# Altium schematic sheet Digital_IO.SchDoc
size A4; SheetNumber: 3; SheetTotal: 4
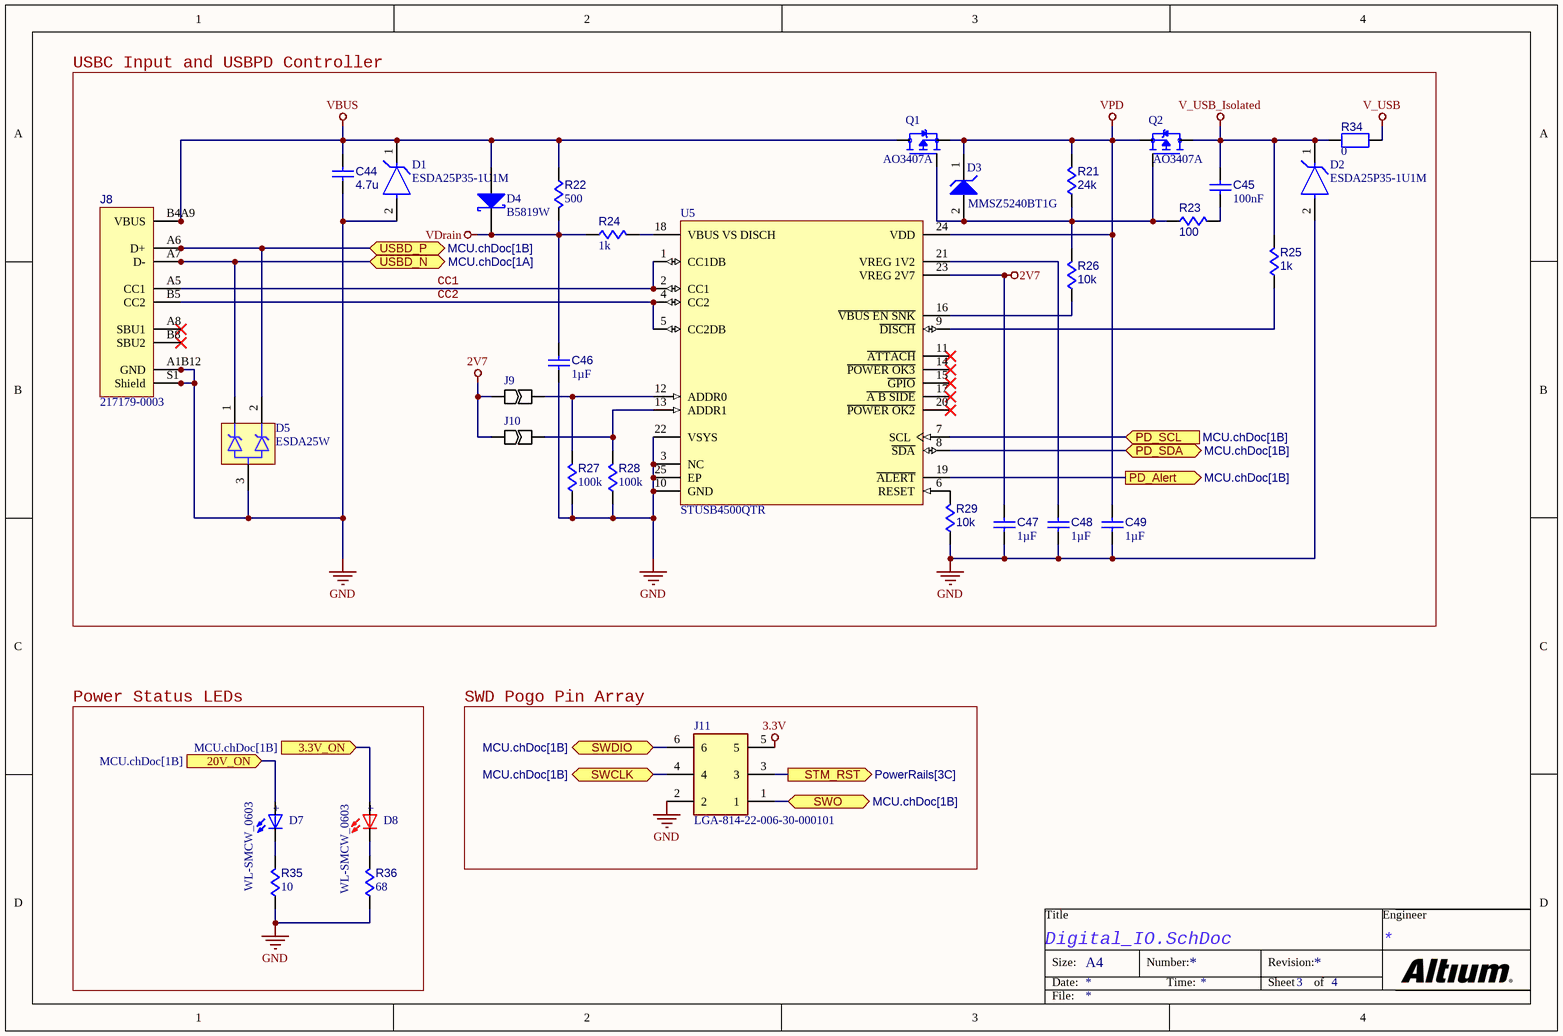
[diagram p0: Digital_IO.SchDoc]

## Parts
C44  value 4.7u  [CAPC0805(2012)145_L]  (hidden comment: Capacitors,0805,4.7u,50V)
C45  value 100nF  [CAPC0402(1005)60_L]  (hidden comment: Capacitor 100nF +/-20% 25V 0402)
C46  value 1µF  [CAPC2013X145X50ML20T25]  (hidden comment: Capacitor 1 uF +/- 10% 25 V 0805)
C47  value 1µF  [CAPC0402(1005)60_L]  (hidden comment: Capacitor 1µF +/-20% 10V 0402)
C48  value 1µF  [CAPC0402(1005)60_L]  (hidden comment: Capacitor 1µF +/-20% 10V 0402)
C49  value 1µF  [CAPC2013X145X50ML20T25]  (hidden comment: Capacitor 1 uF +/- 10% 25 V 0805)
D1  ESDA25P35-1U1M  [FP-QFN_1610-MFG]
D2  ESDA25P35-1U1M  [FP-QFN_1610-MFG]
D3  MMSZ5240BT1G  [ONSC-SOD-123-2-425-04_V]
D4  B5819W  [MCC-SOD123_V]
D5  ESDA25W  [FP-SOT323-3L-IPC_C]
D7  WL-SMCW_0603  [WL-SMCW_0603]
D8  WL-SMCW_0603  [WL-SMCW_0603]
J8  217179-0003  [217179-0003-Footprint-1]
J9  JUMPER  [JUMPER]  (value not drawn)
J10  JUMPER  [JUMPER]  (value not drawn)
J11  LGA-814-22-006-30-000101  [Alignment-8142200630000101]
Q1  AO3407A  [SOT95P280X125-3N]
Q2  AO3407A  [SOT95P280X125-3N]
R21  value 24k  [RESC0402(1005)_L]  (hidden comment: Resistors,0402,24k)
R22  value 500  [RESC0603(1608)_L]  (hidden comment: Resistors,0603,500)
R23  value 100  [RESC0402(1005)_L]  (hidden comment: Resistors,0402,100)
R24  value 1k  [RESC0603(1608)_L]  (hidden comment: Resistors,0603,1k)
R25  value 1k  [RESC0402(1005)_L]  (hidden comment: Resistors,0402,1k)
R26  value 10k  [RESC0402(1005)_L]  (hidden comment: Resistors,0402,10k)
R27  value 100k  [RESC0402(1005)_L]  (hidden comment: Resistors,0402,100k)
R28  value 100k  [RESC0402(1005)_L]  (hidden comment: Resistors,0402,100k)
R29  value 10k  [RESC0402(1005)_L]  (hidden comment: Resistors,0402,10k)
R34  value 0  [RESC0805(2012)_L]  (hidden comment: HCJ0805ZT0R00)
R35  value 10  [RESC0402(1005)_L]  (hidden comment: Resistors,0402,10)
R36  value 68  [RESC0402(1005)_L]  (hidden comment: Resistors,0402,68)
U5  STUSB4500QTR  [FP-QFN-24-EP_4x4-MFG]

## Blocks framed on the sheet
USBC Input and USBPD Controller: C44-C49 D1-D5 J8-J10 Q1 Q2 R21-R29 R34 U5
Power Status LEDs: D7 D8 R35 R36
SWD Pogo Pin Array: J11

## Ports
3.3V_ON (in, see MCU.chDoc[1B]), 20V_ON (in, see MCU.chDoc[1B]), PD_Alert (out, see MCU.chDoc[1B]), PD_SCL (in, see MCU.chDoc[1B]), PD_SDA (bidir, see MCU.chDoc[1B]), STM_RST (out, see PowerRails[3C]), SWCLK (bidir, see MCU.chDoc[1B]), SWDIO (bidir, see MCU.chDoc[1B]), SWO (bidir, see MCU.chDoc[1B]), USBD_N (bidir, see MCU.chDoc[1A]), USBD_P (bidir, see MCU.chDoc[1B])

## Nets
2V7: C47.2 J9.1 J10.1 U5.23(VREG_2V7)
3.3V: J11.5
GND: C44.1 C46.1 C47.1 C48.1 C49.1 D1.2(A) D2.2(A) D5.3(COMMON_ANODE) J8.A1B12(GND) J8.B1A12(GND) J8.S1(Shield) J8.S2(Shield) J8.S3(Shield) J8.S4(Shield) J11.2 R27.1 R28.1 R29.1 R35.1 R36.1 U5.3(NC) U5.10(GND) U5.22(VSYS) U5.25(EP)
V_USB: R34.1
V_USB_Isolated: C45.1 D2.1(C) Q2.3(D) R25.2 R34.2
VBUS: C44.2 D1.1(C) D4.1(A) J8.A4B9(VBUS) J8.B4A9(VBUS) Q1.3(D) R22.2
VDrain: C46.2 D4.2(K) R22.1 R24.2
VPD: C49.2 D3.1(K) Q1.2(S) Q2.2(S) R21.2 U5.24(VDD)
3.3V_ON: D8.2(POS) ; port 3.3V_ON
20V_ON: D7.2(POS) ; port 20V_ON
CC1: J8.A5(CC1) U5.1(CC1DB) U5.2(CC1)
CC2: J8.B5(CC2) U5.4(CC2) U5.5(CC2DB)
PD_Alert: U5.19(~{ALERT}) ; port PD_Alert
PD_SCL: U5.7(SCL) ; port PD_SCL
PD_SDA: U5.8(~{SDA}) ; port PD_SDA
STM_RST: J11.3 ; port STM_RST
SWCLK: J11.4 ; port SWCLK
SWDIO: J11.6 ; port SWDIO
SWO: J11.1 ; port SWO
USBD_N: D5.1(1_CATHODE) J8.A7(D-) J8.B7(D-) ; port USBD_N
USBD_P: D5.2(2_CATHODE) J8.A6(D+) J8.B6(D+) ; port USBD_P
NetC45_2: C45.2 R23.2
NetC48_2: C48.2 U5.21(VREG_1V2)
NetD3_2: D3.2(A) Q1.1(G) Q2.1(G) R21.1 R23.1 R26.2
NetD7_1: D7.1(NEG) R35.2
NetD8_1: D8.1(NEG) R36.2
NetJ9_2: J9.2 R27.2 U5.12(ADDR0)
NetJ10_2: J10.2 R28.2 U5.13(ADDR1)
NetR24_1: R24.1 U5.18(VBUS_VS_DISCH)
NetR25_1: R25.1 U5.9(~{DISCH})
NetR26_1: R26.1 U5.16(~{VBUS_EN_SNK})
NetR29_2: R29.2 U5.6(RESET)

Not connected (* = marked no-connect by the designer): J8 A8(SBU1)* B8(SBU2)*; U5 11(~{ATTACH})* 14(~{POWER_OK3})* 15(~{GPIO})* 17(~{A_B_SIDE})* 20(~{POWER_OK2})*

## Notes on the sheet
- Title
- Engineer
- Size:
- Date:
- A4
- Number:
- Time:
- Revision:
- Sheet
- of
- File:
- (in symbol CMP-004-00035-2) +
- (in symbol CMP-004-00036-3) +

## Library data of the parts
C44 = Capacitors: Capacitor; Case/Package: 0805; Voltage Rating: 50V; Component Type: Capacitors
C45 = CMP-001-00065-7: Chip Capacitor, 100nF +/-20%, 25V, 0402, Thickness 0.6 mm; Tolerance: 10%; Mounting Technology: SMT; Case/Package: 0402; Pins: 2; Min Operating Temperature: -55°C; Max Operating Temperature: 85°C; Voltage Rating: 25V
C46 C49 = CMP-001-00010-9: Chip Capacitor, 1 uF, +/-10%, 25 V, 0805 (2012 Metric); Capacitor Type: Ceramic; Voltage Rating: 25V; Mounting Technology: SM; Case/Package: 0805; Pins: 2; RoHS Compliant: True; Min Operating Temperature: -55°C; Max Operating Temperature: 125°C; Tolerance: 10%
C47 C48 = CMP-001-00063-6: Chip Capacitor, 1µF +/-20%, 10V, 0402, Thickness 0.6 mm; Tolerance: 10%; Pins: 2; Mounting Technology: SMT; Case/Package: 0402; Max Operating Temperature: 85°C; Voltage Rating: 10V; Min Operating Temperature: -55°C
D1 D2 = CMP-12225-000030-1: TVS DIODE 22V 41V 1610; Manufacturer: STMicroelectronics; Clamping Voltage: 39V; Breakdown Voltage: 23.3V; Max Junction Temp: +150°C; Peak Pulse Current: 35A; Number Of Channels: 1; Peak Pulse Power: 1400W; Standoff Height: 0.02mm; Direction: Unidirectional; ComponentLink2URL: https://www.st.com/resource/en/datasheet/esda25p35-1u1m.pdf; Height: 0.6mm; Device Class L2: TVS Diodes; Temperature: -55°C to +150°C; Category: Diode; Temperature Range Low: -55°C; Digikey Description: TVS DIODE 22V 41V 1610; Reverse Standoff Voltage: 22V; Lead Free: Yes; Automotive: No; RoHS: TRUE; Manufacturer Part Number: ESDA25P35-1U1M; Temperature Range High: +150°C; Package: QFN_1610; Device Class L1: Circuit Protection; Device Class L3: unset; ComponentLink2Description: Datasheet; Octopart: https://octopart.com/esda25p35-1u1m-stmicroelectronics-75302699; Mouser Description: ESDA Series 1400 W 25 V Uni-Directional Surface Mount TVS Diode - QFN-1610
D3 = CMP-1060-00549-1: Zener Voltage Regulator, 500 mW, 2-Pin SOD-123, Pb-Free, Tape and Reel; Manufacturer: On Semiconductor; P Max (W): 0.5; VZ Typ (V): 10; PackageVersion: Rev. G, 10/2009; ComponentLink2Description: Datasheet; RoHS: Pb-Free; ComponentLink2URL: http://www.onsemi.com/pub_link/Collateral/MMSZ5221BT1-D.PDF; PackageReference: SOD-123-2-425-04; ComponentLink1URL: http://www.onsemi.com/; ComponentLink3Description: Package Specification; ComponentLink1Description: Manufacturer URL; Packing: Tape and Reel; Mounting Technology: Surface Mount; ComponentLink3URL: http://www.onsemi.com/pub_link/Collateral/425-04.PDF; PackageDescription: 2-Pin SOD, Body 1.6 x 2.69 mm; PartNumber: MMSZ5240BT1G; DatasheetVersion: Rev. 12
D4 = CMP-004-00005-2: Schottky Barrier Rectifier, 40 V, 1 A, -65 to 125 degC, 2-Pin SOD123, RoHS, Tape and Reel; Manufacturer: Micro Commercial Components; Datasheet Version: Rev. B, 01/2013; RoHS Compliant: Unknown; Manufacturer URL: http://www.mccsemi.com/; Package URL: http://www.mccsemi.com/up_pdf/1N4448W(SOD-123).pdf; Case/Package: SOD123; Mounting Technology: SM; Datasheet URL: http://www.mccsemi.com/up_pdf/B5817W-B5819W(SOD-123).pdf; Package Description: 2-Pin Small Outline Diode, Body 2.7 x 1.6 mm, Height 1.35 mm; Package Reference: SOD123
D5 = CMP-004-00032-1: 25V 400W 25V 24V SOT-323-3L ESD and Surge Protection (TVS/ESD) ROHS; ESD Protection: Yes; Max Reverse Leakage Current: 1µA; Number of Channels: 2; Direction: Unidirectional; Breakdown Voltage: 27.5V; Max Junction Temperature (Tj): 125°C; Element Configuration: Common Anode; Power Rating: 150W; Forward Voltage: 1.2V; Max Breakdown Voltage: 30V; Power Line Protection: No; Value: 65pF; Test Current: 1mA; Length: 2mm; Lead Free: Lead Free; Reverse Standoff Voltage: 24V; Peak Pulse Power: 400W; Harmonized Tariff Schedule (HTS) Code: 8541.10.00.50; Height: 1.1mm; Schedule B: 8536300000, 8536300000; Min Breakdown Voltage: 25V; Width: 1.25mm; Termination: SMD/SMT; Max Power Dissipation: 400W; Working Voltage: 24V; Number of Elements: 2; Leakage Current: 1µA; Export Control Classification Number (ECCN) Code: EAR99; Pins: 3; Introduction Date: 1980-01-04; Case/Package: SOT-323; Radiation Hardening: No; Reverse Breakdown Voltage: 25V; Mounting Technology: Surface Mount; Operating Supply Voltage: 1.2V; Number of Terminals: 3; REACH SVHC: Yes; Polarity: Unidirectional; Depth: 1.25mm; Number of Unidirectional Channels: 2; Lifecycle Status: Production; RoHS: Compliant; Country of Origin: Mainland China; Peak Reverse Current: 1µA; Composition: Zener; Max Operating Temperature: 125°C; China RoHS: Compliant; Min Operating Temperature: -40°C; Voltage Rating (DC): 25V
D7 = CMP-004-00035-2: 0603, Blue Typ.(@20mA): 470nm, 145mcd, 3.2V, 140Â° InGaN; MP: 150060BS75000; MF: Wurth Electronics; Check_prices: https://www.snapeda.com/parts/150060BS75000/Wurth+Electronics/view-part/?ref=eda; Component Type: Standard; Case/Package: 0603 Wurth Electronics; Design Item ID: WL-SMCW_0603; Pins: 2; Source: WL-SMCW_0603.SchLib; SnapEDA_Link: https://www.snapeda.com/parts/150060BS75000/Wurth+Electronics/view-part/?ref=snap; Value: *
D8 = CMP-004-00036-3: 0603, Red Typ.(@20mA): 625nm, 250mcd, 2.0V, 140Â° AlInGaP; MP: 150060RS75000; MF: Wurth Electronics; Pins: 2; Source: WL-SMCW_0603.SchLib; SnapEDA_Link: https://www.snapeda.com/parts/150060RS75000/Wurth+Electronics/view-part/?ref=snap; Case/Package: 0603 WÃ¼rth Elektronik; Component Type: Standard; Design Item ID: WL-SMCW_0603; Check_prices: https://www.snapeda.com/parts/150060RS75000/Wurth+Electronics/view-part/?ref=eda; Value: *
J8 = CMP-002-00084-5: Conn USB Type C RCP 16 POS 0.5mm Solder RA SMD 16 Terminal 1 Port USB T/R; Manufacturer: Molex; Connector Type: USBC; Gender: Receptacle; Max Current Rating: 5A; Case/Package: None; RoHS: Compliant; Lifecycle Status: Production; Value: *; Component Type: Standard
J9 J10 = CMP-009-00061-10: Pins: 2
J11 = CMP-002-00083-5: MILL MAX - 814-22-006-30-000101 - CONNECTOR, HEADER, 2.54MM, 6POS, SMT; Manufacturer_Name: Mill-Max; Geometry.Height: 6.48mm; Mouser Part Number: 575-8142200630000101; Design Item ID: 814-22-006-30-000101; Manufacturer_Part_Number: 814-22-006-30-000101; Datasheet Link: https://www.mill-max.com/products/datasheet/sockets/814-22-006-30-000101; Source: 814-22-006-30-000101.SchLib; Mouser Price/Stock: https://www.mouser.com/Search/Refine.aspx?Keyword=575-8142200630000101; Arrow Part Number: 814-22-006-30-000101; Arrow Price/Stock: https://www.arrow.com/en/products/814-22-006-30-000101/mill-max
Q1 Q2 = CMP-012-000000-1: P-Channel 30 V 4.3A (Ta) 1.4W (Ta) Surface Mount SOT-23-3; MF: Alpha &; Source: AO3407A.SchLib; SnapEDA_Link: https://www.snapeda.com/parts/AO3407A/Alpha/view-part/?ref=snap; Component Type: Standard; Pin Count: 3; Value: *; MP: AO3407A; Design Item ID: AO3407A; Check_prices: https://www.snapeda.com/parts/AO3407A/Alpha/view-part/?ref=eda; Package: SOT-23 Alpha &amp; Omega Semiconductor
R21-R26 = Resistors: Resistor; Component Type: Resistors
  R21 R23 R25 R26: Case/Package: 0402
  R22 R24: Case/Package: 0603
R27-R29 R35 R36 = Resistors: Resistor, Bootstrap; Case/Package: 0402; Component Type: Resistors
R34 = CMP-009-00179-2: HCJ Series 0805 Jumper Surface Mount Chip Resistor; Manufacturer Package Identifier: 0805 (2012 metric); Power Rating: 500mW; DNP: TRUE; Mounting Technology: Surface Mount; Case/Package: 0805; Min Operating Temperature: -55°C; Max Operating Temperature: 155°C; Number of Terminals: 2; Export Control Classification Number (ECCN) Code: EAR99; Ratings: AEC-Q200; Radiation Hardening: No; Width: 1.2mm; Number of Terminations: 2; Length: 2mm; REACH SVHC: Yes; Harmonized Tariff Schedule (HTS) Code: 8533.21.00.30; Introduction Date: 2013-09-03; Termination: Wraparound; Lead Free: Lead Free; Packaging: Cut Tape (CT); Case Code (Metric): 2012; RoHS: Compliant; Country of Origin: Taiwan; Lifecycle Status: Production; Schedule B: 8533210045, 8533210045; Case Code (Imperial): 0805; Height: 650µm; Composition: Metal Strip
U5 = CMP-015-00008-2: Super Speed USB Controller USB 1.2/USB 2.0 5V/9V/12V/15V/18V T/R 24-Pin QFN EP; Max Supply Voltage: 22V; Number of Ports: 1; USB Standard: USB 2.0; Nominal Supply Voltage (DC): 5V; Max Junction Temperature (Tj): 145°C; Interface: I2C, USB; Min Supply Voltage: 4.1V; Number of Circuits: 1; Introduction Date: 2018-04-09; Harmonized Tariff Schedule (HTS) Code: 8542.39.00.60; Height: 1mm; Height - Seated (Max): 1mm; Lifecycle Status: Production; Width: 4mm; Schedule B: 8542390000, 8542390000; Number of Channels: 1; RoHS: Compliant; Export Control Classification Number (ECCN) Code: EAR99; Length: 4mm; Country of Origin: Mainland China; Number of Terminals: 26; Terminal Pitch: 500µm; REACH SVHC: Yes; Max Operating Temperature: 105°C; Min Operating Temperature: -40°C; China RoHS: Compliant; Ambient Temperature Range High: 105°C